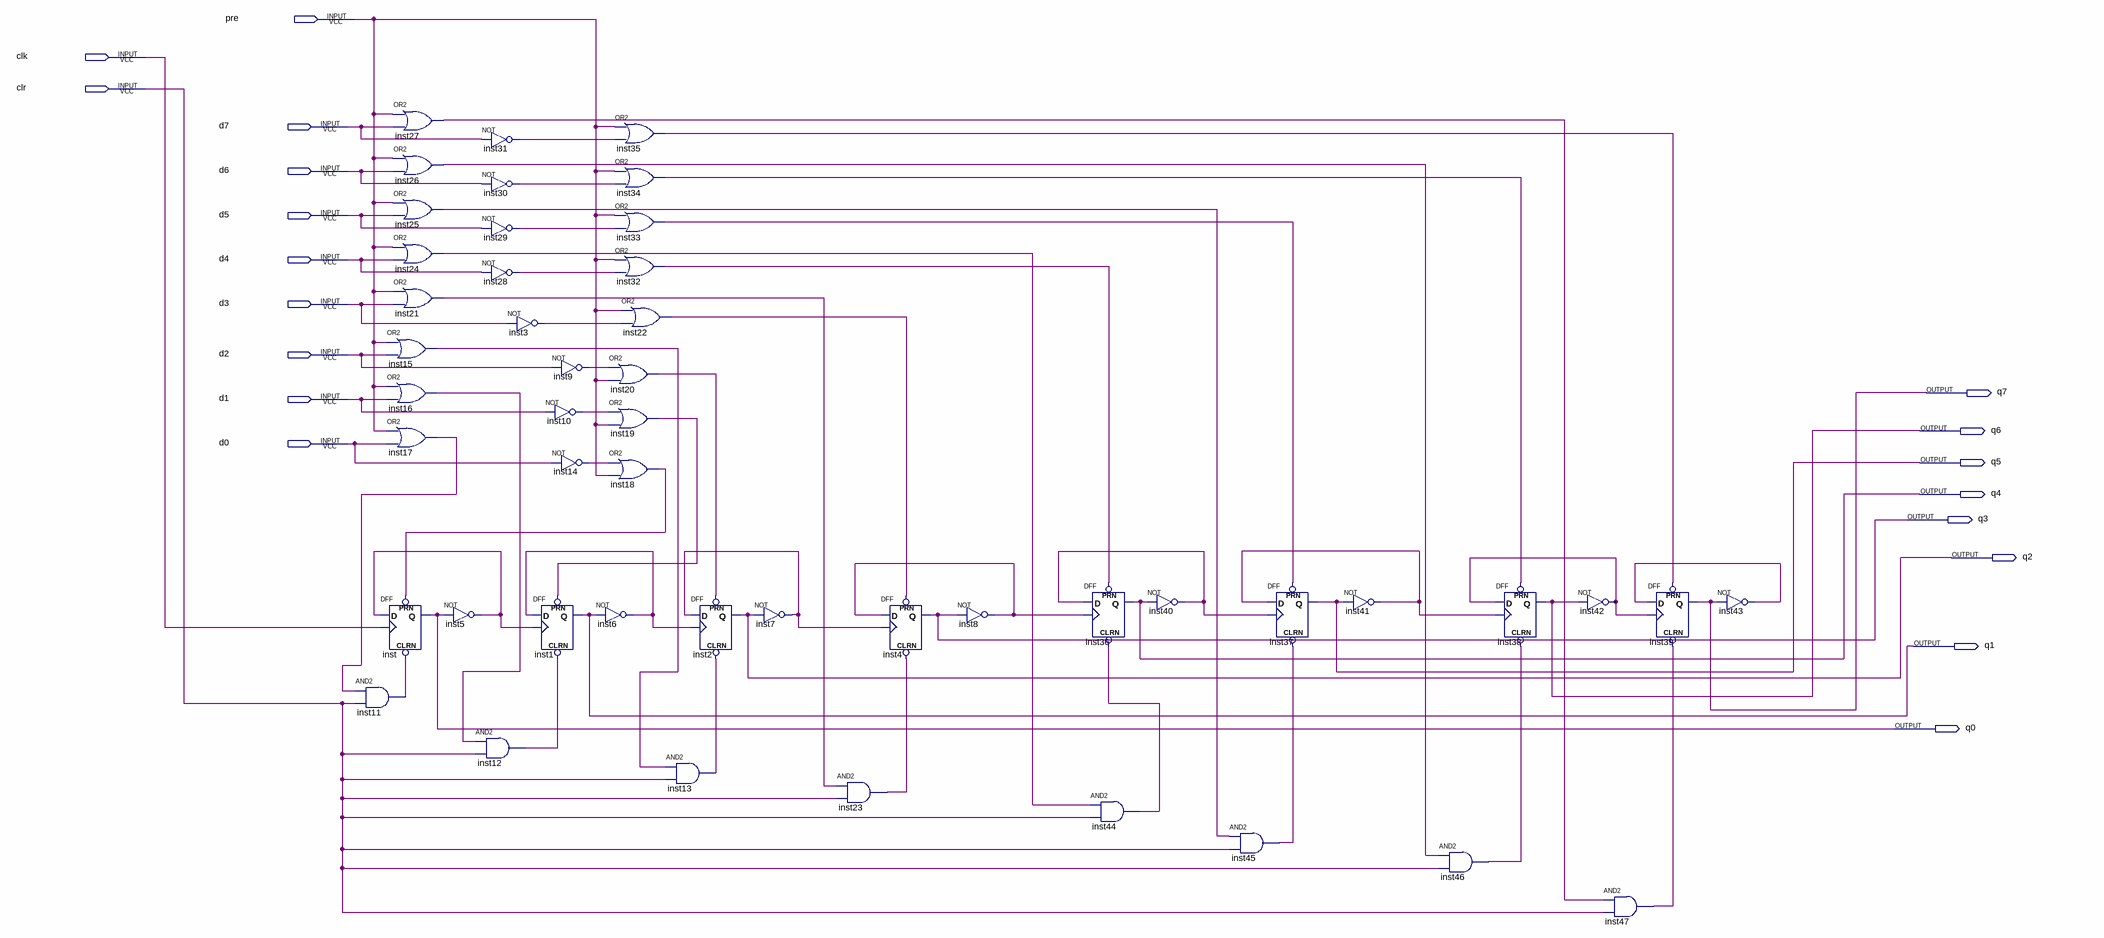
[diagram p0: schematic sheet]
// Quartus schematic counter-256.bdf as structural Verilog: 48 symbols, 19 pins
module \counter-256  (
  input  pre,
  input  clk,
  input  clr,
  input  d7,
  input  d6,
  input  d5,
  input  d4,
  input  d3,
  input  d2,
  input  d1,
  input  d0,
  output q7,
  output q6,
  output q5,
  output q4,
  output q3,
  output q2,
  output q1,
  output q0
);

  wire inst3_out, inst5_out, inst6_out, inst7_out, inst8_out, inst9_out, inst10_out, inst11_out, inst12_out,
       inst13_out, inst14_out, inst15_out, inst16_out, inst17_out, inst18_out, inst19_out, inst20_out,
       inst21_out, inst22_out, inst23_out, inst24_out, inst25_out, inst26_out, inst27_out, inst28_out,
       inst29_out, inst30_out, inst31_out, inst32_out, inst33_out, inst34_out, inst35_out, inst40_out,
       inst41_out, inst42_out, inst43_out, inst44_out, inst45_out, inst46_out, inst47_out;

  and inst11 (inst11_out, inst17_out, clr);
  or inst27 (inst27_out, pre, d7);
  or inst26 (inst26_out, pre, d6);
  or inst25 (inst25_out, pre, d5);
  or inst24 (inst24_out, pre, d4);
  or inst21 (inst21_out, pre, d3);
  or inst15 (inst15_out, pre, d2);
  or inst16 (inst16_out, pre, d1);
  or inst17 (inst17_out, pre, d0);
  DFF inst (.CLRN(inst11_out), .CLK(clk), .D(inst5_out), .PRN(inst18_out), .Q(q0));
  not inst5 (inst5_out, q0);
  not inst31 (inst31_out, d7);
  not inst30 (inst30_out, d6);
  not inst29 (inst29_out, d5);
  not inst28 (inst28_out, d4);
  not inst3 (inst3_out, d3);
  and inst12 (inst12_out, inst16_out, clr);
  not inst9 (inst9_out, d2);
  not inst10 (inst10_out, d1);
  not inst14 (inst14_out, d0);
  DFF inst1 (.CLRN(inst12_out), .CLK(inst5_out), .D(inst6_out), .PRN(inst19_out), .Q(q1));
  or inst35 (inst35_out, pre, inst31_out);
  or inst34 (inst34_out, pre, inst30_out);
  or inst33 (inst33_out, pre, inst29_out);
  or inst32 (inst32_out, pre, inst28_out);
  or inst22 (inst22_out, pre, inst3_out);
  or inst20 (inst20_out, inst9_out, pre);
  or inst19 (inst19_out, inst10_out, pre);
  or inst18 (inst18_out, inst14_out, pre);
  not inst6 (inst6_out, q1);
  and inst13 (inst13_out, inst15_out, clr);
  DFF inst2 (.CLRN(inst13_out), .CLK(inst6_out), .D(inst7_out), .PRN(inst20_out), .Q(q2));
  not inst7 (inst7_out, q2);
  and inst23 (inst23_out, inst21_out, clr);
  DFF inst4 (.CLRN(inst23_out), .CLK(inst7_out), .D(inst8_out), .PRN(inst22_out), .Q(q3));
  not inst8 (inst8_out, q3);
  DFF inst36 (.CLRN(inst44_out), .CLK(inst8_out), .D(inst40_out), .PRN(inst32_out), .Q(q4));
  and inst44 (inst44_out, inst24_out, clr);
  not inst40 (inst40_out, q4);
  and inst45 (inst45_out, inst25_out, clr);
  DFF inst37 (.CLRN(inst45_out), .CLK(inst40_out), .D(inst41_out), .PRN(inst33_out), .Q(q5));
  not inst41 (inst41_out, q5);
  and inst46 (inst46_out, inst26_out, clr);
  DFF inst38 (.CLRN(inst46_out), .CLK(inst41_out), .D(inst42_out), .PRN(inst34_out), .Q(q6));
  not inst42 (inst42_out, q6);
  and inst47 (inst47_out, inst27_out, clr);
  DFF inst39 (.CLRN(inst47_out), .CLK(inst42_out), .D(inst43_out), .PRN(inst35_out), .Q(q7));
  not inst43 (inst43_out, q7);
endmodule
